# EAGLE design Display-Board_Rack-PDU_1.0 (EAGLE 9.6.2)
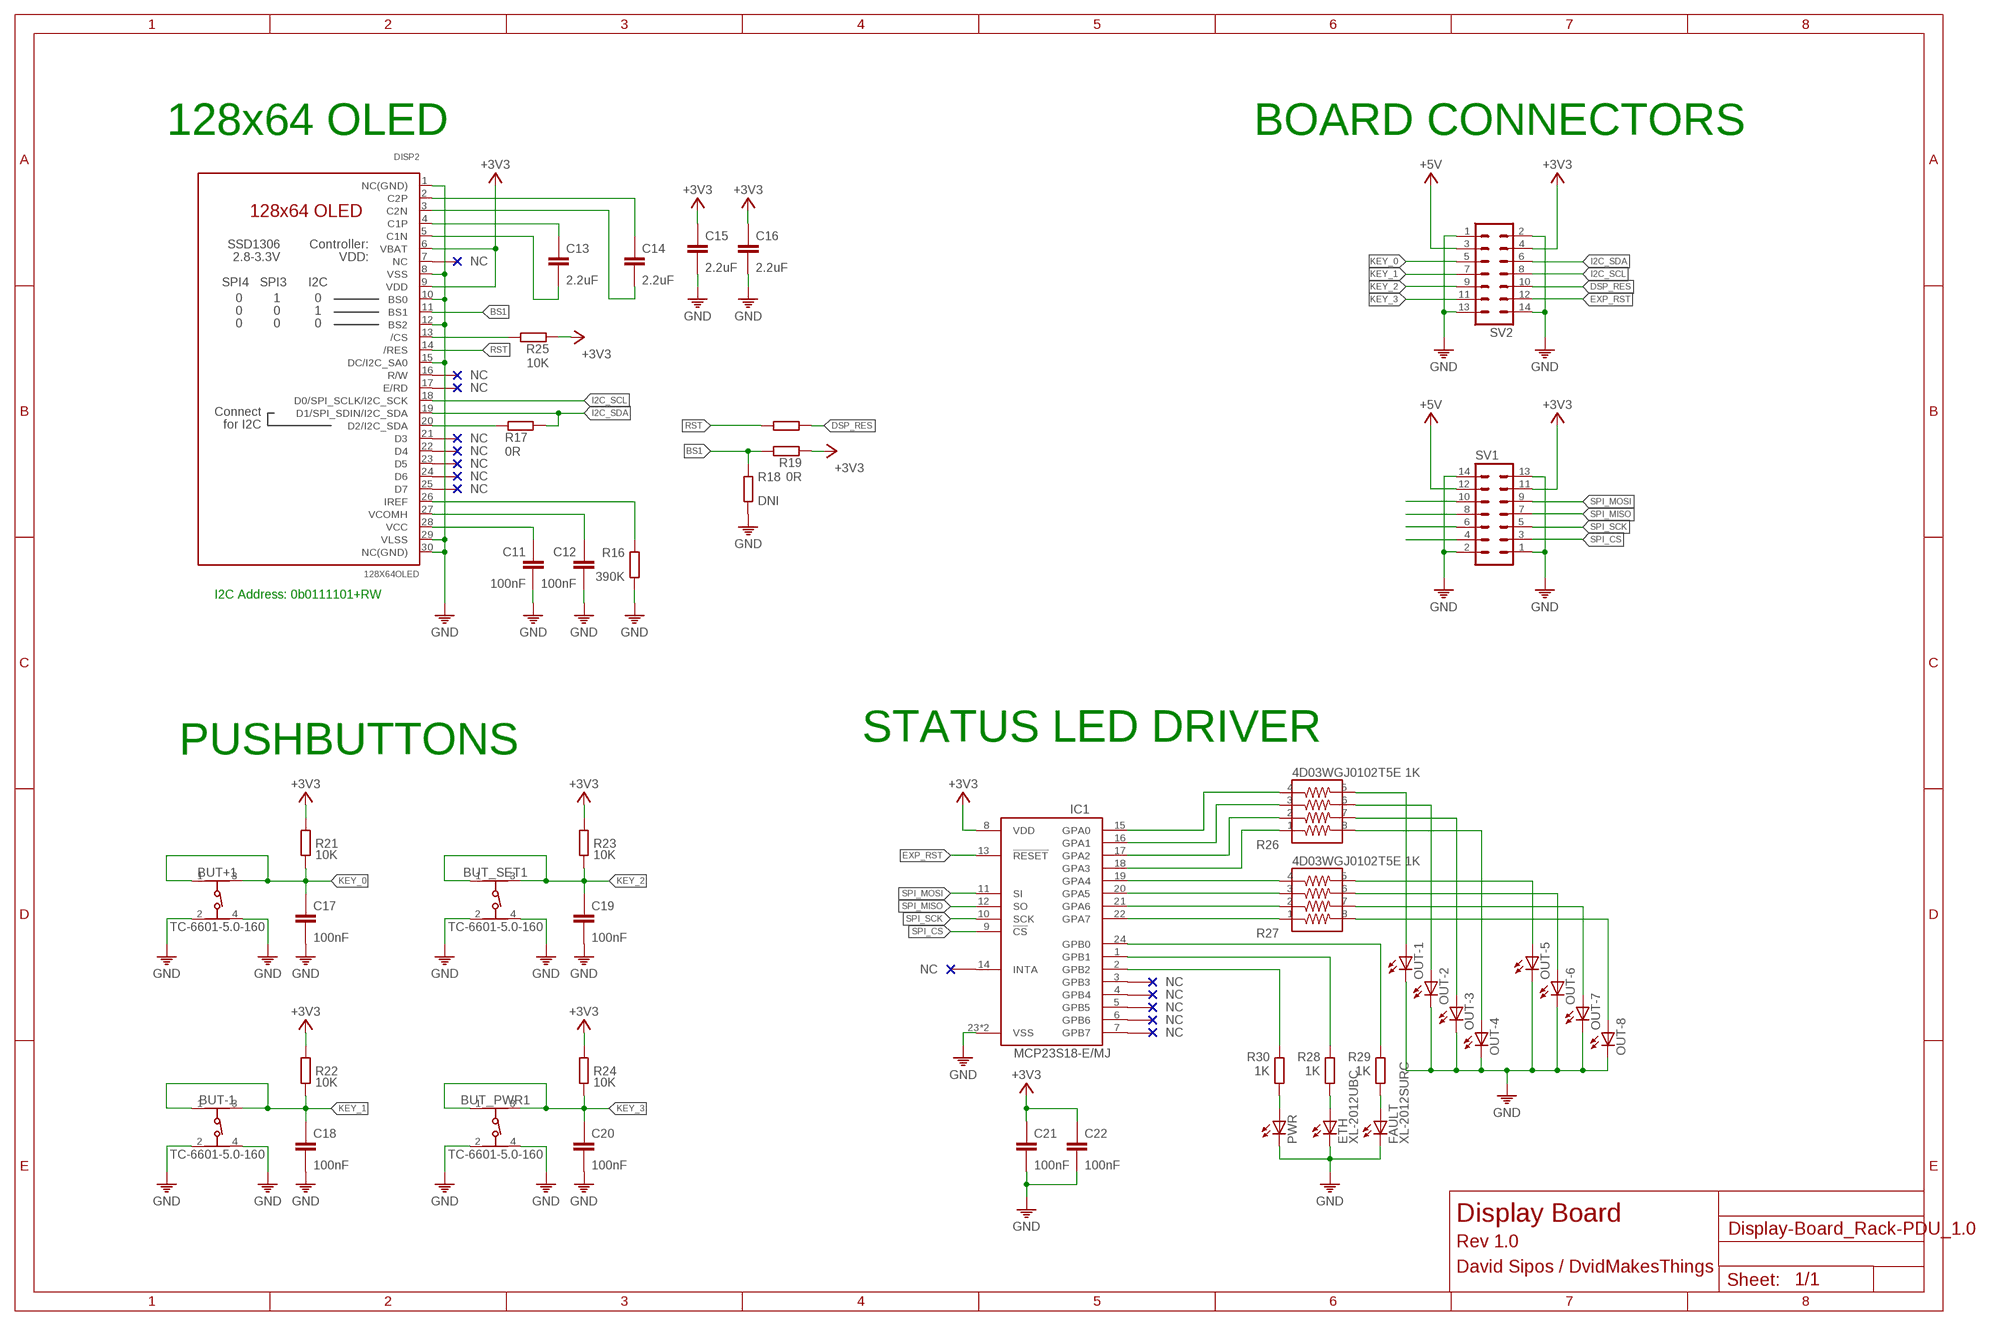
[diagram p0: schematic, sheet 1]

## Parts
BUT+1  TC-6601-5.0-160  430182043816  [430182043816]
BUT-1  TC-6601-5.0-160  430182043816  [430182043816]
BUT_PWR1  TC-6601-5.0-160  430182043816  [430182043816]
BUT_SET1  TC-6601-5.0-160  430182043816  [430182043816]
C11  100nF  C0402  [0402]
C12  100nF  C0402  [0402]
C13  2.2uF  C0402  [0402]
C14  2.2uF  C0402  [0402]
C15  2.2uF  C0402  [0402]
C16  2.2uF  C0402  [0402]
C17  100nF  C0402  [0402]
C18  100nF  C0402  [0402]
C19  100nF  C0402  [0402]
C20  100nF  C0402  [0402]
C21  100nF  C0402  [0402]
C22  100nF  C0402  [0402]
DISP2  128X64OLED  [UG2864]
ETH  XL-2012UBC  LEDCHIP-LED0805  [CHIP-LED0805]
FAULT  XL-2012SURC  LEDCHIP-LED0805  [CHIP-LED0805]
IC1  MCP23S18-E/MJ  MCP23S18  [QFN50P400X400X100-25T265]
OUT-1  LEDCHIP-LED0805  [CHIP-LED0805]
OUT-2  LEDCHIP-LED0805  [CHIP-LED0805]
OUT-3  LEDCHIP-LED0805  [CHIP-LED0805]
OUT-4  LEDCHIP-LED0805  [CHIP-LED0805]
OUT-5  LEDCHIP-LED0805  [CHIP-LED0805]
OUT-6  LEDCHIP-LED0805  [CHIP-LED0805]
OUT-7  LEDCHIP-LED0805  [CHIP-LED0805]
OUT-8  LEDCHIP-LED0805  [CHIP-LED0805]
PWR  LEDCHIP-LED0805  [CHIP-LED0805]
R16  390K  R0402  [0402]
R17  0R  R0402  [0402]
R18  DNI  R0402  [0402]
R19  0R  R0402  [0402]
R20  0R  R0402  [0402]
R21  10K  R0402  [0402]
R22  10K  R0402  [0402]
R23  10K  R0402  [0402]
R24  10K  R0402  [0402]
R25  10K  R0402  [0402]
R26  4D03WGJ0102T5E 1K  742C083103JP  [742C083103JP]
R27  4D03WGJ0102T5E 1K  742C083103JP  [742C083103JP]
R28  1K  R0402  [0402]
R29  1K  R0402  [0402]
R30  1K  R0402  [0402]
SV1  MA07-2W  [MA07-2W]
SV2  MA07-2W  [MA07-2W]

## Nets
+3V3: C15.1 C16.1 C21.1 C22.1 DISP2.6(VBAT) DISP2.9(VDD) IC1.8(VDD) R19.1 R21.1 R22.1 R23.1 R24.1 R25.1 SV1.11 SV2.4
+5V: SV1.12 SV2.3
BS1: DISP2.11(BS1) R18.1 R19.2
DSP_RES: R20.2 SV2.10
EXP_RST: IC1.13(!RESET) SV2.12
GND: BUT+1.2 BUT+1.4 BUT-1.2 BUT-1.4 BUT_PWR1.2 BUT_PWR1.4 BUT_SET1.2 BUT_SET1.4 C11.2 C12.2 C15.2 C16.2 C17.2 C18.2 C19.2 C20.2 C21.2 C22.2 DISP2.1(NC(GND)) DISP2.8(VSS) DISP2.10(BS0) DISP2.12(BS2) DISP2.15(DC/I2C_SA0) DISP2.29(VLSS) DISP2.30(NC(GND)) ETH.C FAULT.C IC1.23(VSS) IC1.25(VSS) OUT-1.C OUT-2.C OUT-3.C OUT-4.C OUT-5.C OUT-6.C OUT-7.C OUT-8.C PWR.C R16.2 R18.2 SV1.1 SV1.2 SV1.13 SV1.14 SV2.1 SV2.2 SV2.13 SV2.14
I2C_SCL: DISP2.18(D0/SPI_SCLK/I2C_SCK) SV2.8
I2C_SDA: DISP2.19(D1/SPI_SDIN/I2C_SDA) R17.2 SV2.6
KEY_0: BUT+1.1 BUT+1.3 C17.1 R21.2 SV2.5
KEY_1: BUT-1.1 BUT-1.3 C18.1 R22.2 SV2.7
KEY_2: BUT_SET1.1 BUT_SET1.3 C19.1 R23.2 SV2.9
KEY_3: BUT_PWR1.1 BUT_PWR1.3 C20.1 R24.2 SV2.11
N$22: C13.2 DISP2.5(C1N)
N$35: C13.1 DISP2.4(C1P)
N$36: C14.2 DISP2.3(C2N)
N$37: C14.1 DISP2.2(C2P)
N$38: DISP2.26(IREF) R16.1
N$39: C11.1 DISP2.28(VCC)
N$40: C12.1 DISP2.27(VCOMH)
N$41: DISP2.20(D2/I2C_SDA) R17.1
N$42: SV1.10
N$43: SV1.8
N$44: SV1.6
N$45: SV1.4
N$46: IC1.1(GPB1) R28.1
N$47: IC1.2(GPB2) R30.1
N$48: IC1.24(GPB0) R29.1
N$49: DISP2.13(/CS) R25.2
N$50: IC1.15(GPA0) R26.4
N$51: IC1.16(GPA1) R26.3
N$52: IC1.17(GPA2) R26.2
N$53: IC1.18(GPA3) R26.1
N$54: IC1.19(GPA4) R27.4
N$55: IC1.20(GPA5) R27.3
N$56: IC1.21(GPA6) R27.2
N$57: IC1.22(GPA7) R27.1
N$58: OUT-1.A R26.5
N$59: OUT-2.A R26.6
N$60: OUT-3.A R26.7
N$61: OUT-4.A R26.8
N$62: OUT-5.A R27.5
N$63: OUT-6.A R27.6
N$64: OUT-7.A R27.7
N$65: OUT-8.A R27.8
N$66: FAULT.A R29.2
N$67: ETH.A R28.2
N$68: PWR.A R30.2
RST: DISP2.14(/RES) R20.1
SPI_CS: IC1.9(!CS) SV1.3
SPI_MISO: IC1.12(SO) SV1.7
SPI_MOSI: IC1.11(SI) SV1.9
SPI_SCK: IC1.10(SCK) SV1.5
Unconnected: DISP2.7(NC) DISP2.16(R/W) DISP2.17(E/RD) DISP2.21(D3) DISP2.22(D4) DISP2.23(D5) DISP2.24(D6) DISP2.25(D7) IC1.3(GPB3) IC1.4(GPB4) IC1.5(GPB5) IC1.6(GPB6) IC1.7(GPB7) IC1.14(INTA)

## Notes on the sheet
- 128x64 OLED | BOARD CONNECTORS
- I2C Address: 0b0111101+RW
- PUSHBUTTONS | STATUS LED DRIVER
- Display Board
- Rev 1.0
- David Sipos / DvidMakesThings

## Library data of the parts
BUT+1 BUT-1 BUT_PWR1 BUT_SET1 = Wurth_Switch_WS-TASV:430182043816: WS-TASV SMT Tact Switch 6x6 mm Material Properties Cover Material : Stainless Steel Properties Actuator Material:LCP Actuator Flammability :UL94 V-0 Rating Actuator Color:Black; Salmon; White Frame Material:LCP Flammability Rating:UL94 V-0 Frame Color:Black Contact Material:Stainless Steel Contact Plating:Silver Terminal Material:Copper Alloy Terminal Plating:Silver VR:12 V (DC) Contact Resistance Initial:100 mΩ Contact Resistance After Life Test:2Ω RISO:100 MΩ Withstanding Voltage:250 V (AC) Washable:No Qty.:4000;5000 Mechanical Properties Electrical Life:400; 550; 1000 Stroke :0.25 mm General Information Operating Temperature:-40 up to +85 °C Washable:No Packaging Properties Packaging:Tape and Reel <https://www.we-online.com/catalog/media/o37470v209%20Family_WS-TASV_6x6mm_SMD_Tact_Switch_4301820xx8xx.jpg> Details see: https://www.we-online.com/catalog/en/TASV_6X6_SMD/ Updated by yingchun,Shan;2020-02-18 2020(C) Würth Elektronik; DATASHEET-URL: https://www.we-online.com/redexpert/spec/430182043816?ae; HEIGHT: 4.3mm; OPERATION-FORCE: 160g; PART-NUMBER: 430182043816; QTY: 1000; VALUE: 430182043816
C11-C22 = ds_passive:C
DISP2 = ds_displays:128X64OLED: 128x64 OLED
ETH FAULT OUT-1-OUT-8 PWR = led:LED: LED OSRAM: - CHIPLED LG R971, LG N971, LY N971, LG Q971, LY Q971, LO R971, LY R971 LH N974, LH R974 LS Q976, LO Q976, LY Q976 LO Q996 - Hyper CHIPLED LW Q18S LB Q993, LB Q99A, LB R99A - SideLED LS A670, LO A670, LY A670, LG A670, LP A670 LB A673, LV A673, LT A673, LW A673 LH A674 LY A675 LS A676, LA A676, LO A676, LY A676, LW A676 LS A679, LY A679, LG A679 - Hyper Micro SIDELED® LS Y876, LA Y876, LO Y876, LY Y876 LT Y87S - SmartLED LW L88C, LW L88S LB L89C, LB L89S, LG L890 LS L89K, LO L89K, LY L89K LS L896, LA L896, LO L896, LY L896 - TOPLED LS T670, LO T670, LY T670, LG T670, LP T670 LSG T670, LSP T670, LSY T670, LOP T670, LYG T670 LG T671, LOG T671, LSG T671 LB T673, LV T673, LT T673, LW T673 LH T674 LS T676, LA T676, LO T676, LY T676, LB T676, LH T676, LSB T676, LW T676 LB T67C, LV T67C, LT T67C, LS T67K, LO T67K, LY T67K, LW E67C LS E67B, LA E67B, LO E67B, LY E67B, LB E67C, LV E67C, LT E67C LW T67C LS T679, LY T679, LG T679 LS T770, LO T770, LY T770, LG T770, LP T770 LB T773, LV T773, LT T773, LW T773 LH T774 LS E675, LA E675, LY E675, LS T675 LS T776, LA T776, LO T776, LY T776, LB T776 LHGB T686 LT T68C, LB T68C - Hyper Mini TOPLED® LB M676 - Mini TOPLED Santana® LG M470 LS M47K, LO M47K, LY M47K Source: http://www.osram.convergy.de LUXEON: - LUMILED® LXK2-PW12-R00, LXK2-PW12-S00, LXK2-PW14-U00, LXK2-PW14-V00 LXK2-PM12-R00, LXK2-PM12-S00, LXK2-PM14-U00 LXK2-PE12-Q00, LXK2-PE12-R00, LXK2-PE12-S00, LXK2-PE14-T00, LXK2-PE14-U00 LXK2-PB12-K00, LXK2-PB12-L00, LXK2-PB12-M00, LXK2-PB14-N00, LXK2-PB14-P00, LXK2-PB14-Q00 LXK2-PR12-L00, LXK2-PR12-M00, LXK2-PR14-Q00, LXK2-PR14-R00 LXK2-PD12-Q00, LXK2-PD12-R00, LXK2-PD12-S00 LXK2-PH12-R00, LXK2-PH12-S00 LXK2-PL12-P00, LXK2-PL12-Q00, LXK2-PL12-R00 Source: www.luxeon.com KINGBRIGHT: KA-3528ASYC Source: www.kingbright.com
IC1 = ds_ic_peripherals:MCP23S18: 16-Bit I/O Expander with Open-Drain Outputs
R16-R25 R28-R30 = ds_passive:R
R26 R27 = Resistor Array:742C083103JP: RES ARRAY 4 RES 10K OHM 1206 Manufacturer's datasheet <https://www.ctscorp.com/wp-content/uploads/74x.pdf>; CREATED_BY: PCBLayout.com; DIGIKEY_PN: 742C083103JPTR-ND; MANUFACTURER: CTS Resistor Products; MPN: 742C083103JP; PACKAGE: 1206
SV1 SV2 = con-lstb:MA07-2W: PIN HEADER; OC_FARNELL: unknown; OC_NEWARK: unknown

## Board
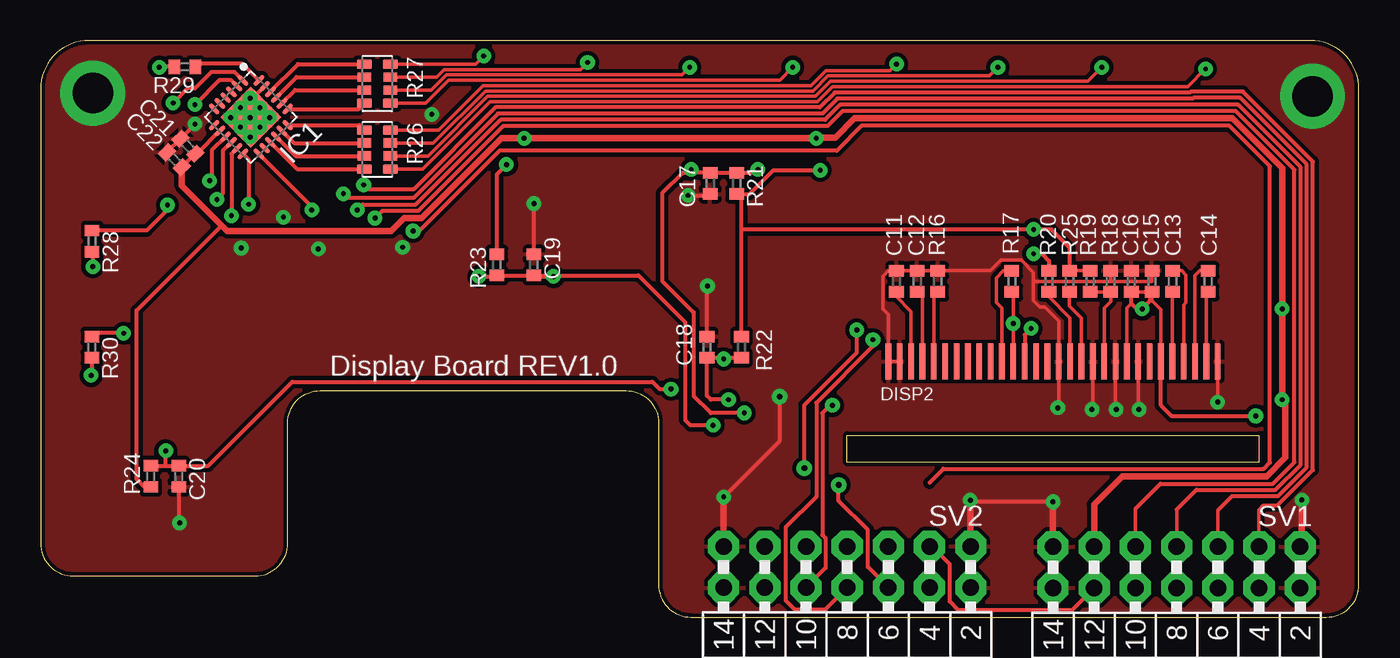
[diagram p1: board, top side]
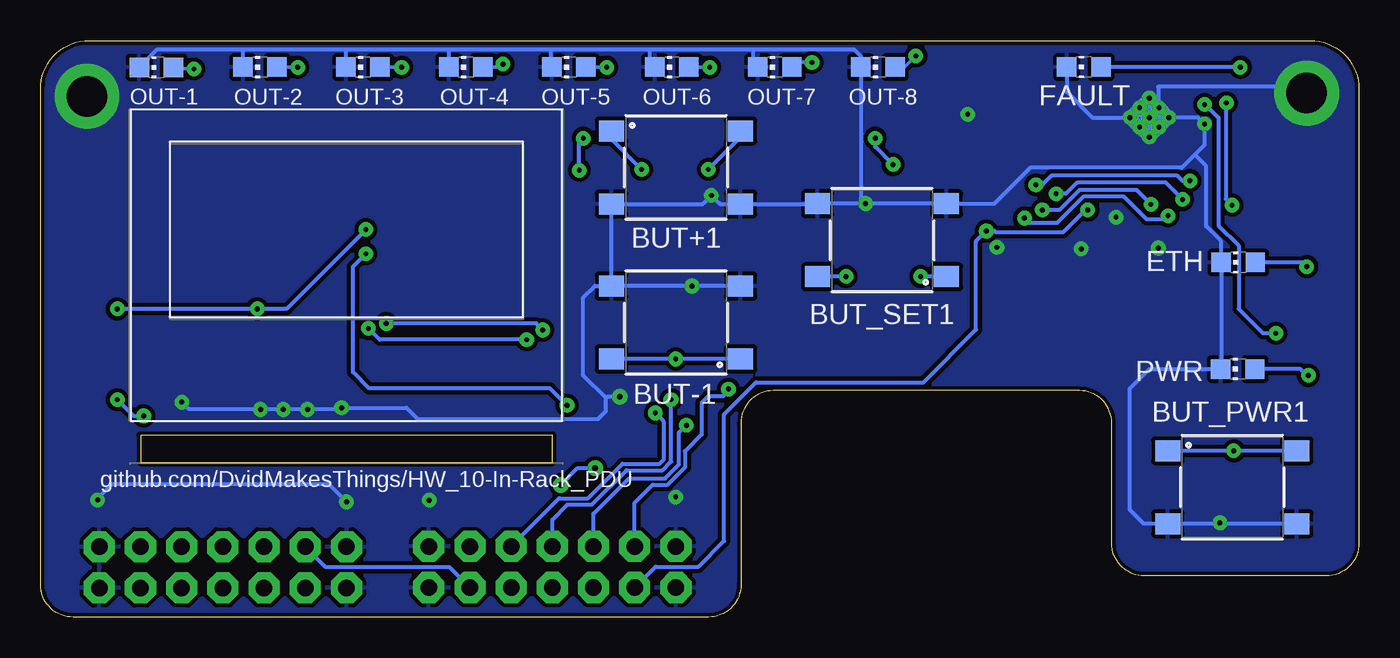
[diagram p2: board, bottom side, seen from below]

Size 81.28 x 35.56 mm. Coordinates in mm from the lower left corner, seen from the top.
Outline: 78.28,35.56 3,35.56 arc90 0,32.56 0,4.54 arc90 2,2.54 13.24,2.54 arc90 15.24,4.54 15.24,11.97 arc-90 17.24,13.97 36.1,13.97 arc-90 38.1,11.97 38.1,2 arc90 40.1,0 79.28,0 arc90 81.28,2 81.28,32.56 arc90 78.28,35.56
Outline: 75.12,9.55 49.72,9.55 49.72,11.22 75.12,11.22 75.12,9.55
Copper layers (1*16): Top 0.035mm / dielectric 1.6mm / Bottom 0.035mm
Design rules "jlcpcb-2layers *": minimum track width 5mil, minimum drill 0.3mm, track to track 5mil, track to pad 5mil, pad to pad 5mil, via to via 5mil, smd to smd 5mil, copper to edge 0.2mm, drill to drill 6mil, minimum pad ring 0.45mm, minimum via ring 0.3mm, stop-mask expansion 4mil, vias tented up to drill 0mil, thermal gap 10mil

### Footprints (pad centres in the part's own frame; a part is rotated, then mirrored left to right if it is on the bottom)
430182043816 = smd 1.55 x 1.3: 1 -3.975,2.25; 2 -3.975,-2.25; 3 3.975,2.25; 4 3.975,-2.25
0402 = smd 0.7 x 0.9: 1 -0.65,0; 2 0.65,0
UG2864 = smd 0.35 x 2.2 bottom: 1 -10.15,-6.28; 2 -9.45,-6.28; 3 -8.75,-6.28; 4 -8.05,-6.28; 5 -7.35,-6.28; 6 -6.65,-6.28; 7 -5.95,-6.28; 8 -5.25,-6.28; 9 -4.55,-6.28; 10 -3.85,-6.28; 11 -3.15,-6.28; 12 -2.45,-6.28; 13 -1.75,-6.28; 14 -1.05,-6.28; 15 -0.35,-6.28; 16 0.35,-6.28; 17 1.05,-6.28; 18 1.75,-6.28; 19 2.45,-6.28; 20 3.15,-6.28; 21 3.85,-6.28; 22 4.55,-6.28; 23 5.25,-6.28; 24 5.95,-6.28; 25 6.65,-6.28; 26 7.35,-6.28; 27 8.05,-6.28; 28 8.75,-6.28; 29 9.45,-6.28; 30 10.15,-6.28
CHIP-LED0805 = smd 1.2 x 1.2: A 0,-1.05; C 0,1.05
QFN50P400X400X100-25T265 = smd 0.811 x 0.264: 1 -1.951,1.25; 2 -1.951,0.75; 3 -1.951,0.25; 4 -1.951,-0.25; 5 -1.951,-0.75; 6 -1.951,-1.25; 13 1.951,-1.25; 14 1.951,-0.75; 15 1.951,-0.25; 16 1.951,0.25; 17 1.951,0.75; 18 1.951,1.25 | smd 0.264 x 0.811: 7 -1.25,-1.951; 8 -0.75,-1.951; 9 -0.25,-1.951; 10 0.25,-1.951; 11 0.75,-1.951; 12 1.25,-1.951; 19 1.25,1.951; 20 0.75,1.951; 21 0.25,1.951; 22 -0.25,1.951; 23 -0.75,1.951; 24 -1.25,1.951 | smd 2.65 x 2.65: 25 0,0
742C083103JP = smd 0.59 x 0.92: 1 -1.2,-0.8; 2 -0.4,-0.8; 3 0.4,-0.8; 4 1.2,-0.8; 5 1.2,0.8; 6 0.4,0.8; 7 -0.4,0.8; 8 -1.2,0.8
MA07-2W = drill 1.016 octagon: 1 -7.62,-1.27; 2 -7.62,1.27; 3 -5.08,-1.27; 4 -5.08,1.27; 5 -2.54,-1.27; 6 -2.54,1.27; 7 0,-1.27; 8 0,1.27; 9 2.54,-1.27; 10 2.54,1.27; 11 5.08,-1.27; 12 5.08,1.27; 13 7.62,-1.27; 14 7.62,1.27

### Placement (x,y rotation side)
BUT+1  42.1,27.73 0 bottom
BUT-1  42.1,18.17 180 bottom
BUT_PWR1  7.81,8.01 0 bottom
BUT_SET1  29.4,23.25 180 bottom
C11  52.77,20.71 90 top
C12  54.04,20.71 90 top
C13  69.79,20.71 270 top
C14  71.98,20.71 90 top
C15  68.52,20.71 90 top
C16  67.25,20.71 90 top
C17  41.28,26.75 270 top
C18  41.08,16.65 90 top
C19  30.42,21.73 90 top
C20  8.52,8.68 270 top
C21  9.08,29.05 135 top
C22  8.25,28.21 135 top
DISP2  62.42,22.05 0 bottom
ETH  7.44,21.88 90 bottom
FAULT  16.96,33.93 90 bottom
IC1  12.96,30.84 315 top
OUT-1  74.14,33.9 90 bottom
OUT-2  67.75,33.92 90 bottom
OUT-3  61.4,33.92 90 bottom
OUT-4  55.05,33.92 90 bottom
OUT-5  48.7,33.92 90 bottom
OUT-6  42.35,33.92 90 bottom
OUT-7  36,33.92 90 bottom
OUT-8  29.65,33.92 90 bottom
PWR  7.47,15.3 90 bottom
R16  55.31,20.71 90 top
R17  59.88,20.71 270 top
R18  65.98,20.71 90 top
R19  64.71,20.71 270 top
R20  62.17,20.71 90 top
R21  42.92,26.75 90 top
R22  43.22,16.65 270 top
R23  28.13,21.73 270 top
R24  6.79,8.68 90 top
R25  63.44,20.71 270 top
R26  20.76,28.84 270 top
R27  20.76,32.9 270 top
R28  3.18,23.19 270 top
R29  8.9,33.94 180 top
R30  3.16,16.65 270 top
SV1  70.04,3.07 180 top
SV2  49.73,3.09 180 top

### Tracks (layer width: path | path; a pad name or v marks a point on that pad's centre or on a via)
+3V3  (via drill 0.3)
  Top 0.203: DISP2.9 66.97,19.06 67.25,19.34 | C16.1 68.42,20.06 C15.1 68.52,19.51 69.07,18.96 DISP2.6 | R25.1 R19.1
  Top 0.254: DISP2.6 69.07,13.06 69.72,12.41 v74.92,12.41 | IC1.8 9.65,28.59 C21.1 C22.1 | R23.1 28.13,27.32 v28.72,27.91 | R21.1 43.22,26.1 | 43.22,26.1 43.71,26.1 45.17,27.56 v48.07,27.56 | R22.1 43.22,23.93 | 43.22,23.93 43.22,26.1 | R24.1 6.4,8.03 5.92,8.51 5.92,18.91 11.17,24.16 | R25.1 63.44,22.79 62.32,23.91 v61.22,23.91 43.24,23.91 43.22,23.93 | 68.42,20.06 68.42,19.51 v67.92,19.01 67.57,19.01 67.25,19.34 C16.1 | 76.74,13.31 76.64,13.41 v76.54,13.41
  Top 0.406: 76.74,13.31 76.74,9.84 75.59,8.69 66.7,8.69 64.96,6.95 SV1.11 | v76.54,13.41 v76.54,19.01 76.54,27.7 73.49,30.76 50.18,30.76 49.01,29.59 47.87,29.59 v47.82,29.54 v29.82,29.54 28.42,29.54 23.49,24.61 22.42,24.61 21.62,23.81 11.52,23.81 11.17,24.16 8.71,26.62 C22.1
  Bottom 0.254: v28.72,27.91 29.82,29.01 v29.82,29.54 | v48.07,27.56 48.07,29.29 v47.82,29.54 | v76.54,13.41 75.54,12.41 v74.92,12.41 | v61.22,23.91 66.12,19.01 v67.92,19.01 v76.54,19.01 | SV2.4 56.07,3.08 63.7,3.08 SV1.11
+5V
  Top 0.254: SV1.12 63.58,0.42 56.6,0.42 56.05,0.97 56.05,3.26 54.95,4.36 SV2.3
BS1
  Top 0.203: DISP2.11 65.57,19.05 65.98,19.46 R18.1 R19.2
DSP_RES  (via drill 0.3)
  Top 0.254: v48.82,13.06 48.67,13.06 48.2,12.59 48.2,5.06 48.4,4.86 48.4,3.03 SV2.10 | v61.22,22.41 61.72,22.41 62.17,21.96 R20.2
  Bottom 0.254: v48.82,13.06 49.87,14.11 61.02,14.11 62.02,15.11 62.02,21.61 v61.22,22.41
EXP_RST  (via drill 0.3)
  Top 0.254: v22.97,23.81 23.34,23.81 28.29,28.76 49.08,28.76 50.62,30.3 73.3,30.3 75.79,27.81 75.79,9.53 75.4,9.14 55.65,9.14 54.8,8.29 | v16.72,25.11 16.72,25.32 IC1.13
  Bottom 0.254: v16.72,25.11 16.88,25.11 18.23,23.76 22.42,23.76 22.47,23.81 v22.97,23.81 23.6,23.18 23.6,17.73 26.85,14.48 37.17,14.48 39.14,12.51 39.14,4.69 40.72,3.11 43.36,3.11 SV2.12
GND  (via drill 0.3, 0.3 pad 0.55, 0.35, 2.5 pad 4)
  Top 0.203: 61.22,20.71 65.92,20.71 | 65.92,20.71 68.52,20.71 C15.2 | 61.22,20.71 61.22,19.51 61.62,19.11 61.92,19.11 62.77,18.26 DISP2.15 62.77,12.96 v62.72,12.91 | R18.2 65.98,20.77 65.92,20.71 | DISP2.12 64.87,12.86 v64.82,12.81 | DISP2.10 66.27,12.86 v66.32,12.81 | DISP2.8 67.67,12.86 v67.72,12.81 | DISP2.1 v72.57,13.26 | DISP2.29 DISP2.30 52.27,18.66 51.92,19.01 51.92,21.01 52.27,21.36 C11.2 C12.2 R16.2 58.57,21.36 59.22,22.01 60.47,22.01 61.22,21.26 61.22,20.71
  Top 0.254: 57.34,7.19 v57.32,7.21 57.42,7.11 v62.42,7.11 | IC1.23 12.96,31.9 IC1.25 | C19.2 v30.42,25.5 | v39.92,26.01 41.19,26.01 C17.2 | C18.2 41.08,20.38 v41.12,20.42 | C20.2 8.52,5.86 v8.57,5.81 | v9.52,30.41 C21.2 C22.2 | 77.71,7.17 v77.76,7.22 | v42.12,7.41 45.58,10.87 v45.58,13.59
  Top 0.305: 42.1,7.39 v42.12,7.41
  Top 0.406: v62.42,7.11 SV1.13 SV1.14 | v77.76,7.22 77.76,4.44 SV1.1 SV1.2 | v57.32,7.21 57.32,4.39 SV2.1 SV2.2 | SV2.14 SV2.13 42.11,7.38 42.1,7.39
  Bottom 0.254: OUT-1.C 74.08,35.01 68.92,35.01 | 68.92,35.01 62.32,35.01 | 62.32,35.01 56.22,35.01 | 56.22,35.01 49.82,35.01 | 49.82,35.01 43.72,35.01 | 43.72,35.01 37.32,35.01 | 37.32,35.01 31.12,35.01 30.7,34.59 OUT-8.C 30.7,25.78 v30.42,25.5 | OUT-7.C 37.32,34.18 37.32,35.01 | OUT-6.C 43.72,34.23 43.72,35.01 | OUT-5.C 49.82,33.98 49.82,35.01 | OUT-4.C 56.1,34.89 56.22,35.01 | OUT-3.C 62.45,34.88 62.32,35.01 | OUT-2.C 68.8,34.89 68.92,35.01 | v30.42,25.5 BUT_SET1.2 22.48,25.5 20.27,27.71 10.92,27.71 10.12,28.51 | v30.42,25.5 BUT_SET1.4 33.4,25.48 BUT+1.4 39.39,25.48 v39.92,26.01 40.45,25.48 BUT+1.2 BUT-1.4 | BUT-1.2 v41.12,20.42 BUT-1.4 | BUT_PWR1.4 8.57,5.76 | 8.57,5.76 BUT_PWR1.2 13.27,5.76 14.12,6.61 14.12,14.11 12.93,15.3 PWR.C 8.49,15.33 ETH.C 8.49,23.18 9.42,24.11 9.42,27.81 10.12,28.51 | v8.57,5.81 8.57,5.76 | v72.57,13.26 72.12,12.81 v67.72,12.81 v66.32,12.81 v64.82,12.81 62.82,12.81 v62.72,12.91 58.72,12.91 58.02,12.21 46.92,12.21 46.42,12.71 46.42,13.51 | BUT-1.4 47.11,20.42 47.82,19.71 47.82,14.91 46.42,13.51 | 77.71,7.17 v77.76,7.22 77.81,7.27 76.87,8.21 63.52,8.21 v62.42,7.11 | 10.12,28.51 9.52,29.11 v9.52,30.41 9.92,30.81 v11.72,30.81 | FAULT.C 18.01,32.4 16.42,30.81 v14.12,30.81 | v3.22,32.32 3.22,32.71 12.37,32.71 12.37,30.91 | v45.58,13.59 46.34,13.59 46.42,13.51
  Bottom 0.813: 12.37,30.16 v11.72,30.81 v12.32,31.41 12.67,31.06 13.17,31.06 | 12.37,30.26 12.37,30.91 12.37,31.46 v12.92,32.01 v13.52,31.41 | 13.27,29.96 v12.92,29.61 12.37,30.16 | 13.27,29.96 v14.12,30.81 v13.52,31.41 | v13.52,31.41 13.17,31.06 | 13.17,31.06 12.37,30.26 | 12.37,30.26 12.37,30.16 | v12.92,30.81 13.27,30.46 13.27,29.96
  other vias: 13.52,30.21 12.32,30.21 78.42,32.12 22.32,22.81 14.97,24.66 17.12,22.71 12.37,22.76 24.12,31.01
  pour Bottom (isolate 0.254): -1.28,36.91 83.52,36.91 83.52,-0.89 -1.28,-0.89
  pour Top (isolate 0.254): -1.08,36.91 83.72,36.91 83.72,-0.89 -1.08,-0.89
I2C_SCL  (via drill 0.3 pad 0.55)
  Top 0.254: v51.32,17.11 51.32,16.71 47.82,13.21 47.82,7.42 45.94,5.54 45.94,1.03 46.49,0.48 48.39,0.48 SV2.8 | v61.07,17.81 60.67,17.41 DISP2.18
  Bottom 0.254: v51.32,17.11 60.37,17.11 v61.07,17.81
I2C_SDA  (via drill 0.3 pad 0.55, 0.35)
  Top 0.203: DISP2.19 v59.97,18.11 59.97,19.97 R17.2
  Top 0.254: v50.32,17.71 50.32,16.31 47.09,13.08 v47.09,9.19 | SV2.6 51,3.09 51,5.38 49.2,7.18 v49.2,8.15
  Bottom 0.254: v50.32,17.71 50.72,18.11 v59.97,18.11 | v49.2,8.15 48.16,9.19 v47.09,9.19
KEY_0  (via drill 0.3)
  Top 0.254: 40.33,27.4 C17.1 R21.2 44.01,27.4 v44.22,27.61 | 40.33,27.4 v40.12,27.61 | 40.33,27.4 40.27,27.4 40.07,27.39 39.57,27.39 38.32,26.14 38.32,20.74 40.27,18.79 40.27,13.64 41.32,12.59 v43.38,12.59
  Bottom 0.254: v40.12,27.61 38.12,29.61 BUT+1.3 | v44.22,27.61 46.08,29.46 BUT+1.1 | v43.38,12.59 42.88,12.09 42.88,9.7 43.12,9.46 45.41,9.46 47.54,7.33 49.3,7.33 SV2.5
KEY_1  (via drill 0.3)
  Top 0.254: R22.2 42.12,16 | 42.12,16 C18.1 41.07,15.98 41.07,13.67 41.33,13.41 v42.41,13.41 | 42.12,16 v42.12,15.92
  Bottom 0.254: BUT-1.1 v42.12,15.92 BUT-1.3 | 42.46,13.46 v42.41,13.41 42.41,9.6 42.95,9.06 45.16,9.06 47.28,6.94 48.79,6.94 49.73,6 SV2.7
KEY_2  (via drill 0.3, 0.3 pad 0.45)
  Top 0.254: v27.02,21.01 28.06,21.01 R23.2 C19.1 | C19.1 30.48,21.01 v31.62,21.01 | C19.1 36.85,21.08 39.74,18.19 39.74,12.15 40.06,11.83 v41.46,11.83
  Bottom 0.254: BUT_SET1.1 v27.01,21 v27.02,21.01 | v31.62,21.01 BUT_SET1.3 | SV2.9 47.19,6.37 45.01,8.55 42.78,8.55 41.94,9.39 41.94,11.35 v41.46,11.83
KEY_3  (via drill 0.3)
  Top 0.254: R24.2 7.72,9.33 | 7.72,9.33 C20.1 10.34,9.33 15.52,14.51 37.72,14.51 38.17,14.06 v38.87,14.06 | 7.72,9.33 v7.72,10.26
  Bottom 0.254: BUT_PWR1.3 v7.72,10.26 BUT_PWR1.1 | v38.87,14.06 38.87,13.96 39.22,13.61 40.12,13.61 40.52,13.21 40.52,11.26 41.56,10.22 41.56,9.23 42.62,8.17 43.54,8.17 44.65,7.06 SV2.11
N$22
  Top 0.203: DISP2.5 69.77,20.04 C13.2
N$35
  Top 0.203: DISP2.4 70.47,19.26 70.62,19.41 70.62,21.11 70.37,21.36 C13.1
N$36
  Top 0.203: DISP2.3 71.17,21.06 71.47,21.36 C14.2
N$37
  Top 0.203: DISP2.2 71.87,19.95 C14.1
N$38
  Top 0.203: DISP2.26 55.07,19.82 R16.1
N$39
  Top 0.203: DISP2.28 53.67,18.86 52.77,19.76 C11.1
N$40
  Top 0.203: DISP2.27 54.37,19.73 C12.1
N$41
  Top 0.203: DISP2.20 59.27,19.06 58.92,19.41 58.92,20.91 59.37,21.36 R17.1
N$46  (via drill 0.3)
  Top 0.254: IC1.1 11.96,33.61 10.52,33.61 9.52,32.61 9.07,32.61 v8.17,31.71 | v7.82,25.41 7.82,25.11 6.55,23.84 R28.1
  Bottom 0.254: v8.17,31.71 8.22,31.66 8.22,25.81 v7.82,25.41
N$47  (via drill 0.3, 0.3 pad 0.45)
  Top 0.254: IC1.2 11.75,33.11 11.02,33.11 v9.52,31.61 | v5.12,17.51 3.37,17.51 R30.1
  Bottom 0.254: v9.52,31.61 9.47,31.61 8.67,30.81 8.67,24.16 7.42,22.91 7.42,19.01 5.92,17.51 v5.12,17.51
N$48
  Top 0.254: R29.1 9.75,34.14 12.42,34.14 IC1.24
N$49
  Top 0.203: DISP2.13 64.17,18.46 63.44,19.19 R25.2
N$50
  Top 0.254: IC1.15 15.81,27.64 R26.4
N$51
  Top 0.254: IC1.16 15.72,28.44 R26.3
N$52
  Top 0.254: IC1.17 15.63,29.24 R26.2
N$53
  Top 0.254: IC1.18 19.66,30.34 R26.1
N$54
  Top 0.254: IC1.19 19.6,31.34 R27.4
N$55
  Top 0.254: IC1.20 15.69,32.5 R27.3
N$56
  Top 0.254: IC1.21 15.78,33.3 R27.2
N$57
  Top 0.254: IC1.22 15.87,34.1 R27.1
N$58  (via drill 0.3)
  Top 0.203: R26.5 23.55,27.64 27.7,31.79 47.9,31.79 48.82,32.71 70.72,32.71 v71.82,33.81
  Bottom 0.203: v71.82,33.81 72.99,33.81 OUT-1.A
N$59  (via drill 0.3)
  Top 0.203: R26.6 23.88,28.44 27.56,32.12 47.77,32.12 48.69,33.04 64.55,33.04 v65.42,33.91
  Bottom 0.203: OUT-2.A v65.43,33.92 v65.42,33.91
N$60  (via drill 0.3)
  Top 0.203: R26.7 24.22,29.24 27.43,32.45 47.63,32.45 48.55,33.38 58.49,33.38 v59.02,33.91
  Bottom 0.203: OUT-3.A v59.03,33.92 v59.02,33.91
N$61  (via drill 0.3)
  Top 0.203: R26.8 24.55,30.04 27.29,32.78 47.49,32.78 48.42,33.71 52.37,33.71 v52.77,34.11
  Bottom 0.203: OUT-4.A 52.96,33.92 v52.77,34.11
N$62  (via drill 0.3)
  Top 0.203: R27.5 23.75,31.7 25.16,33.11 45.57,33.11 v46.37,33.91
  Bottom 0.152: OUT-5.A
  Bottom 0.203: OUT-5.A v46.38,33.92 v46.37,33.91
N$63  (via drill 0.3)
  Top 0.203: R27.6 24.08,32.5 25.02,33.44 39.55,33.44 v40.02,33.91
  Bottom 0.152: v40.02,33.91 v40.03,33.92
  Bottom 0.203: v40.02,33.91 OUT-6.A
N$64  (via drill 0.3)
  Top 0.203: R27.7 24.41,33.3 24.88,33.77 33.28,33.77 v33.72,34.21
  Bottom 0.203: v33.72,34.21 34.66,34.21 OUT-7.A
N$65  (via drill 0.3)
  Top 0.203: R27.8 26.81,34.1 v27.32,34.61
  Bottom 0.152: 28.31,34.21 OUT-8.A
  Bottom 0.203: OUT-8.A 28.01,33.92 v27.32,34.61
N$66  (via drill 0.3 pad 0.45)
  Top 0.254: R29.2 7.35,33.94 v7.32,33.91
  Bottom 0.254: v7.32,33.91 15.89,33.91 FAULT.A
N$67  (via drill 0.3)
  Top 0.254: R28.2 3.22,22.5 v3.22,21.61
  Bottom 0.254: v3.22,21.61 3.49,21.88 ETH.A
N$68  (via drill 0.3)
  Top 0.254: R30.2 3.16,14.95 v3.12,14.91
  Bottom 0.254: v3.12,14.91 3.22,14.91 3.61,15.3 PWR.A
RST
  Top 0.203: DISP2.14 63.47,18.46 62.17,19.76 R20.1
SPI_CS  (via drill 0.3)
  Top 0.203: 75.12,6.61 SV1.3
  Top 0.254: 75.12,6.61 75.19,6.67 75.4,6.89 76.25,6.89 78.44,9.08 78.44,28.09 74.12,32.41 70.92,32.41 70.87,32.36 48.97,32.36 48.05,31.44 28.05,31.44 23.02,26.41 20.17,26.41 v19.92,26.66 | IC1.9 10.56,28.79 10.56,27.05 v10.42,26.91
  Bottom 0.254: v10.42,26.91 10.88,26.91 11.19,27.22 18.95,27.22 19.51,26.66 v19.92,26.66
SPI_MISO  (via drill 0.3)
  Top 0.203: 70.04,6.63 SV1.7
  Top 0.254: 70.04,6.63 71.26,7.85 76.14,7.85 77.68,9.39 77.68,27.75 73.84,31.59 49.29,31.59 48.36,30.67 28.36,30.67 23.14,25.45 19.86,25.45 v19.52,25.11 | IC1.12 12.82,28.23 v12.82,25.46
  Bottom 0.254: v12.82,25.46 13.72,26.36 17.22,26.36 18.47,25.11 v19.52,25.11
SPI_MOSI  (via drill 0.3)
  Top 0.203: 67.5,6.69 SV1.9
  Top 0.254: 67.5,6.69 69.04,8.23 75.98,8.23 77.3,9.55 77.3,27.59 73.68,31.21 49.45,31.21 48.52,30.29 28.52,30.29 23.29,25.07 21.08,25.07 v20.62,24.61 | IC1.11 11.77,28.58 v11.77,24.76
  Bottom 0.254: v11.77,24.76 11.97,24.56 13.12,24.56 14.49,25.93 17,25.93 18.62,24.31 20.32,24.31 v20.62,24.61
SPI_SCK  (via drill 0.3)
  Top 0.203: 72.58,6.57 SV1.5
  Top 0.254: 72.58,6.57 73.48,7.47 76.29,7.47 78.06,9.24 78.06,27.93 73.96,32.03 71.08,32.03 71.03,31.98 49.13,31.98 48.21,31.05 28.2,31.05 23.03,25.88 18.9,25.88 v18.67,26.11 | IC1.10 11.24,28.76 11.24,26.13 v10.87,25.76
  Bottom 0.254: v10.87,25.76 11.9,26.79 17.39,26.79 18.07,26.11 v18.67,26.11

### Text on the board
tPlace: Display Board REV1.0
bPlace: github.com/DvidMakesThings/HW_10-In-Rack_PDU